# EAGLE design Traid (EAGLE 5.11)
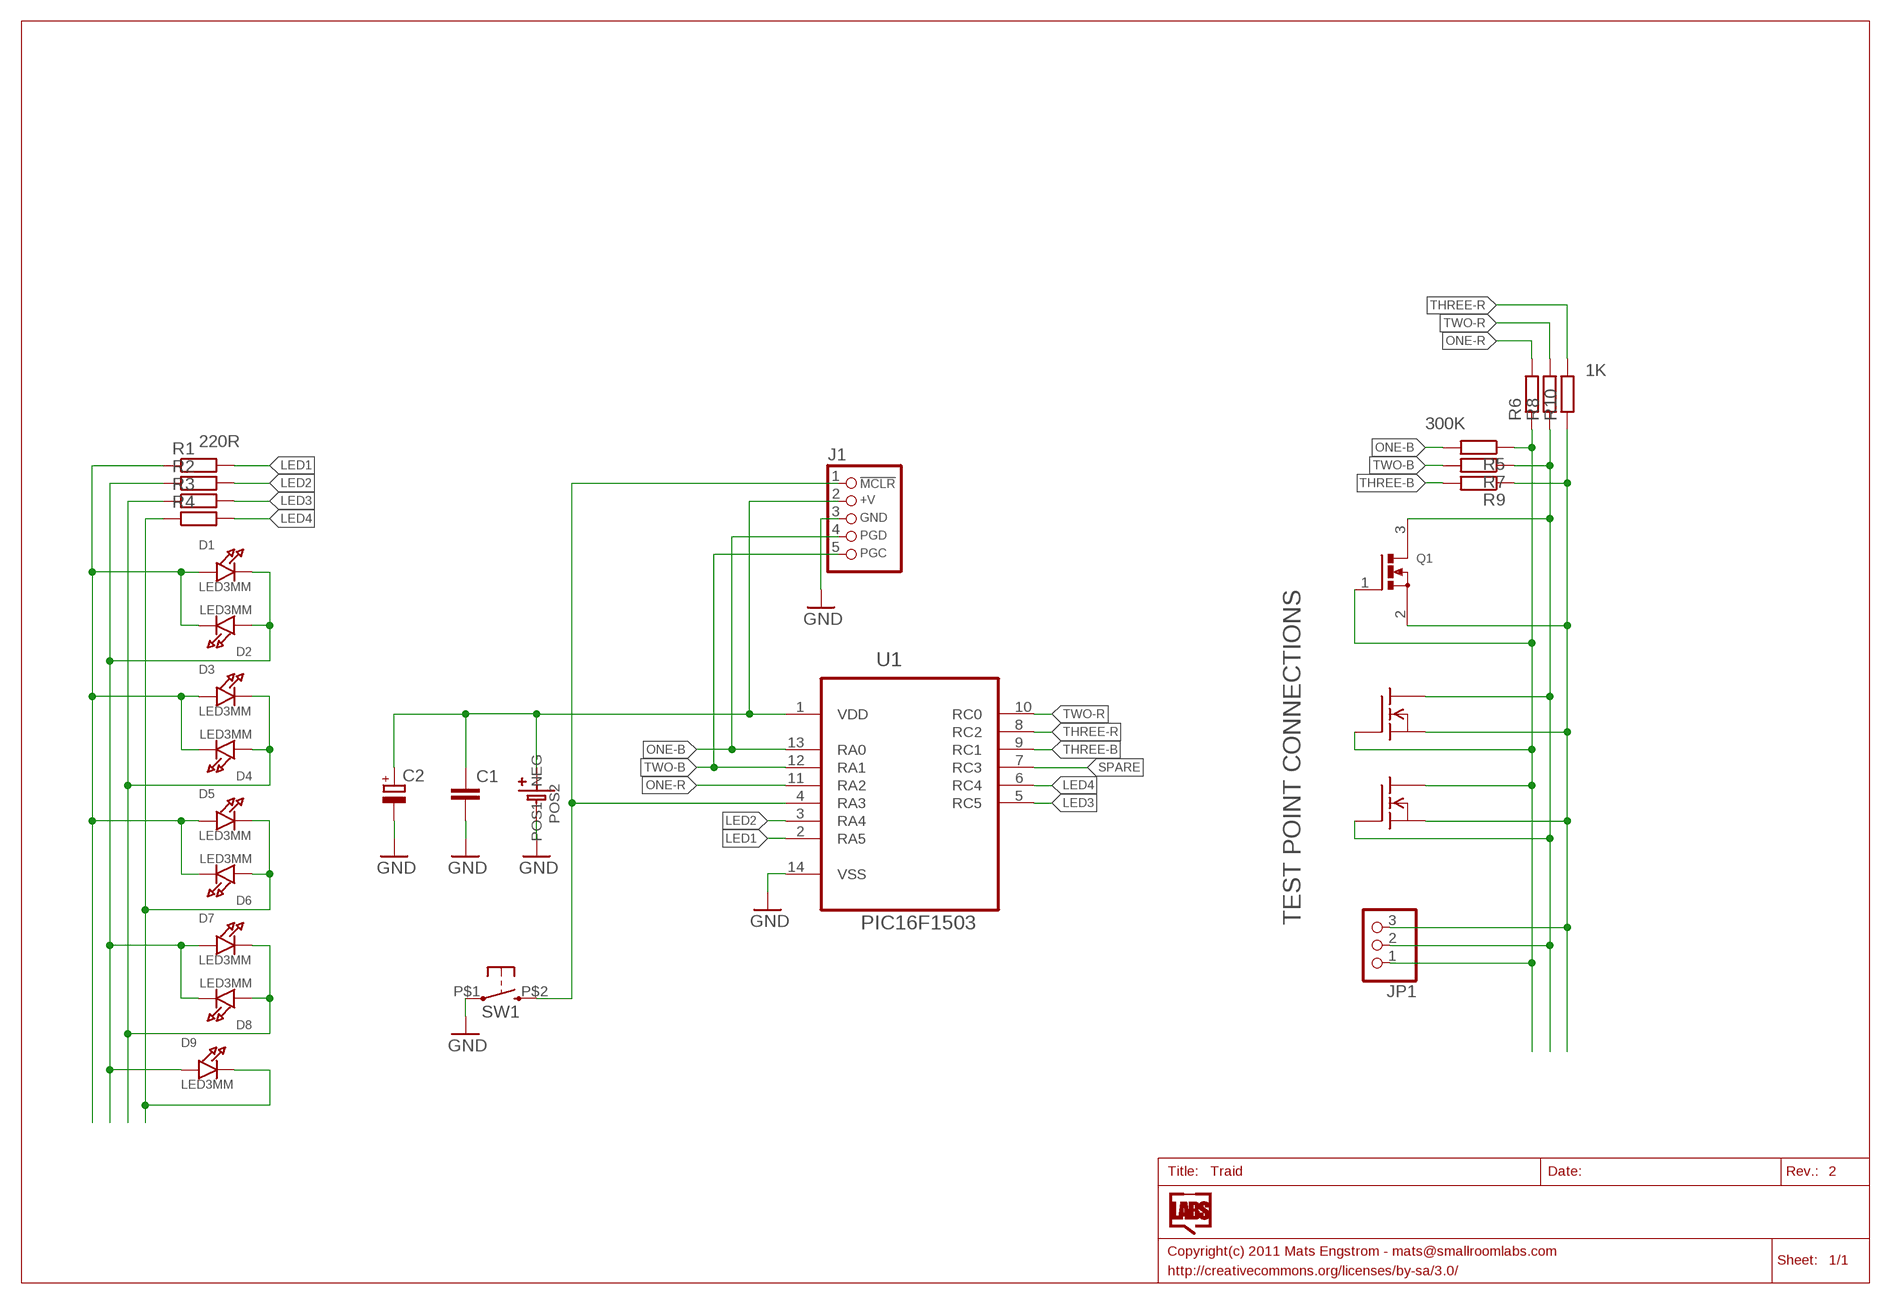
[diagram p0: schematic, sheet 1]

## Parts
C1  C-EU025-025X050  [C025-025X050]
C2  CPOL-EUE2.5-5  [E2,5-5]
D1  LED3MM  [LED3MM]
D2  LED3MM  [LED3MM]
D3  LED3MM  [LED3MM]
D4  LED3MM  [LED3MM]
D5  LED3MM  [LED3MM]
D6  LED3MM  [LED3MM]
D7  LED3MM  [LED3MM]
D8  LED3MM  [LED3MM]
D9  LED3MM  [LED3MM]
J1  CON_HEADER_PRG_PIC_ICSPB  [HEADER_PRG_1X05_ICSP_B]
JP1  HEADER-1X3ROUND  [1X03_ROUND]
Q1  MOSFET-NWAVE  [SOT23-W]
Q2  FQN1N50C  [TO92]
Q3  FQN1N50CI  [TO92-INLINE]
R1  R-EU_0204/5  [0204/5]
R2  R-EU_0204/5  [0204/5]
R3  R-EU_0204/5  [0204/5]
R4  R-EU_0204/5  [0204/5]
R5  R-EU_0204/5  [0204/5]
R6  R-EU_0204/5  [0204/5]
R7  R-EU_0204/5  [0204/5]
R8  R-EU_0204/5  [0204/5]
R9  R-EU_0204/5  [0204/5]
R10  R-EU_0204/5  [0204/5]
SW1  TACTILE1PTH  [TACT3X6PTH]
U1  PIC16F1503  [DIL14-A]
U$3  BATTERY-NOBOTSTOP  [CR2032-PTH-CHEAP]

## Nets
GND [pwr]: C1.2 C2.- J1.3(GND) SW1.P$1(1A) U1.14(VSS) U$3.NEG
LED1: R1.2 U1.2(RA5)
LED1A: D1.A D2.C D3.A D4.C D5.A D6.C R1.1
LED2: R2.2 U1.3(RA4)
LED2A: D1.C D2.A D7.A D8.C D9.A R2.1
LED3: R3.2 U1.5(RC5)
LED3A: D3.C D4.A D7.C D8.A R3.1
LED4: R4.2 U1.6(RC4)
LED4A: D5.C D6.A D9.C R4.1
N$1 [pwr]: C1.1 C2.+ J1.2(+V) U1.1(VDD) U$3.POS@1(POS1)
ONE: JP1.1 Q1.1(G) Q2.1(G) Q3.1(D) R5.1 R6.1
ONE-B: J1.4(PGD) R5.2 U1.13(RA0)
ONE-R: R6.2 U1.11(RA2)
RESET: J1.1(/MCLR) SW1.P$2(2A) U1.4(RA3)
SPARE: U1.7(RC3)
THREE: JP1.3 Q1.2(S) Q2.3(S) Q3.3(S) R9.1 R10.1
THREE-B: R9.2 U1.9(RC1)
THREE-R: R10.2 U1.8(RC2)
TWO: JP1.2 Q1.3(D) Q2.2(D) Q3.2(G) R7.1 R8.1
TWO-B: J1.5(PGC) R7.2 U1.12(RA1)
TWO-R: R8.2 U1.10(RC0)

## Notes on the sheet
- 1K
- 300K
- 220R
- TEST POINT CONNECTIONS

## Power pins joined to a net without a drawn wire
POS2: U$3.POS@3(POS2)

## Library data of the parts
C1 = rcl:C-EU: CAPACITOR, European symbol
C2 = rcl:CPOL-EU: POLARIZED CAPACITOR, European symbol
D1-D9 = SmallRoomLabs:LED
J1 = dp_devices:CON_HEADER_PRG_PIC_ICSP: 5-pin PIC In Circuit Serial Programming header
JP1 = microbuilder:HEADER-1X3: PIN HEADER
Q1 = microbuilder:MOSFET-N: N-Channel Mosfet Digikey: 2N7002ET1GOSTR-ND
Q2 Q3 = adafruit:FQN1N50C: N-Channel Enhancement MOSFET 500V, 0.4A, 6.0 Ohm
R1-R10 = resistor:R-EU_: RESISTOR, European symbol
SW1 = SmallRoomLabs:TACTILE1
U1 = SmallRoomLabs:PIC16F1503: MCU 8BIT 3.5KB FLASH ,DIP-14; MPN: PIC16F1503-I/P; OC_FARNELL: 2068608; OC_NEWARK: 55T3633; PACKAGE: DIP-14; SUPPLIER: Microchip
U$3 = SmallRoomLabs:BATTERY: A23 Farnell/E14 908721

## Net classes
0 default: width 0.203 mm, drill 0.305 mm, clearance 0.203 mm
1 pwr: width 0.356 mm, drill 0.305 mm, clearance 0.356 mm

## Board
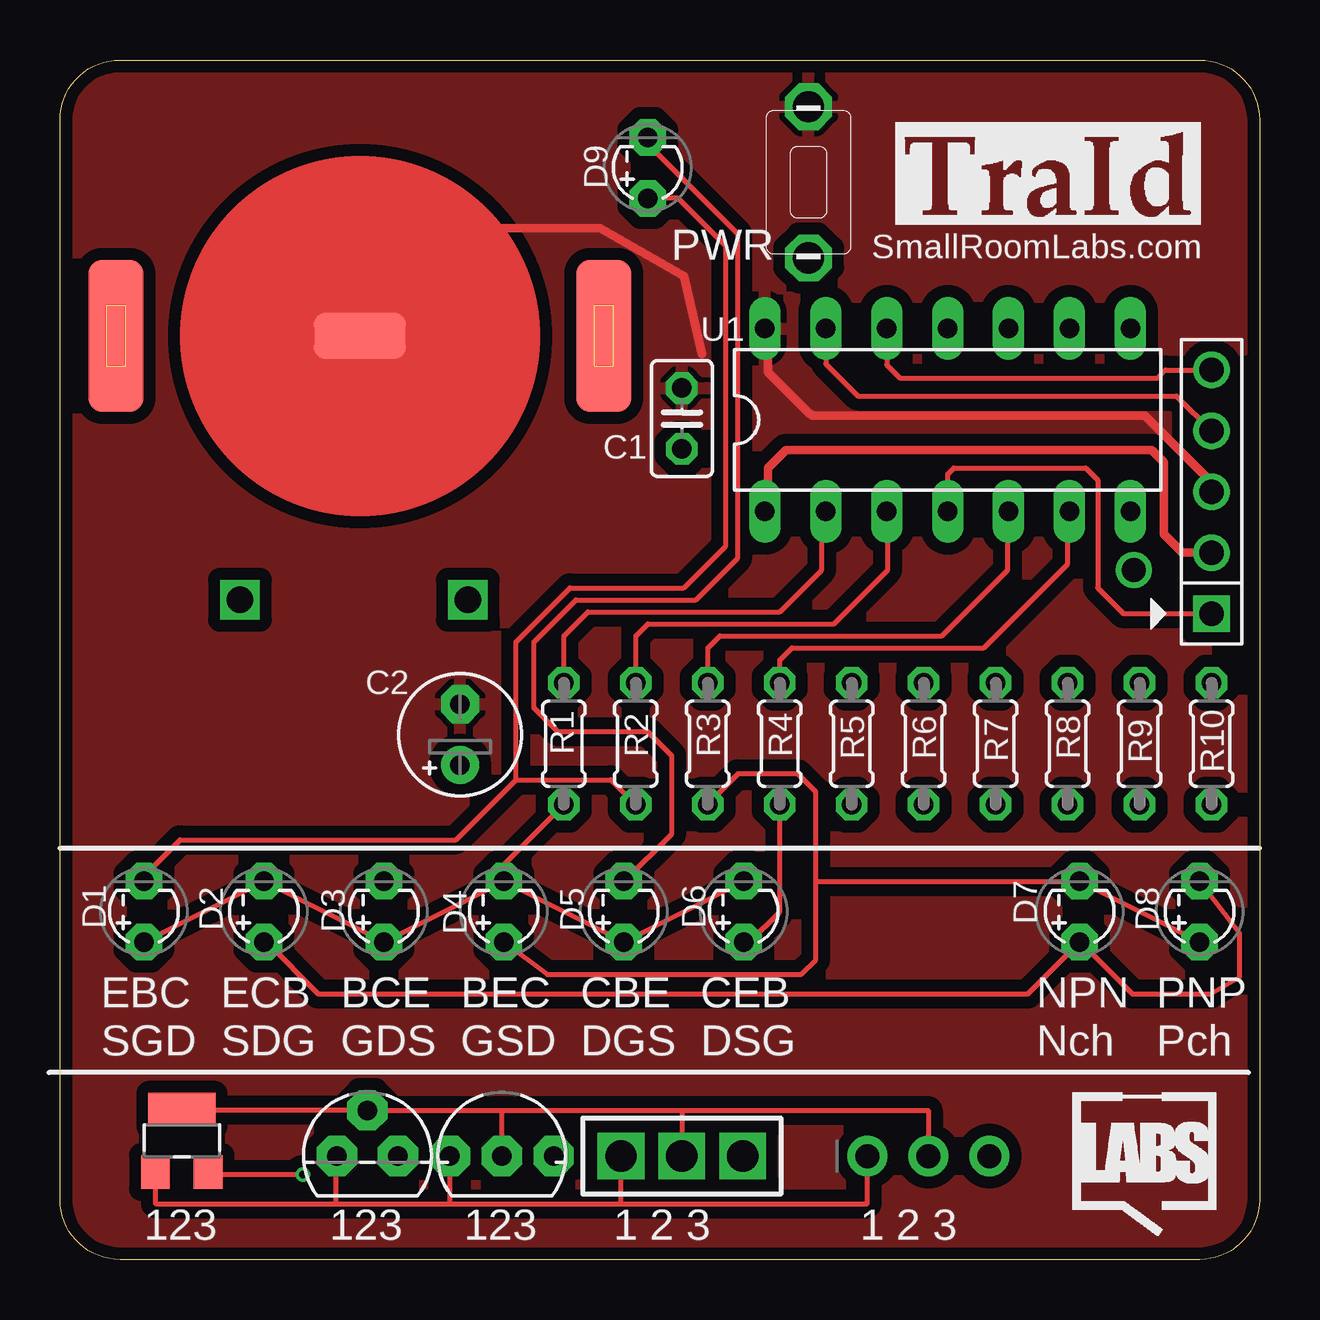
[diagram p1: board, top side]
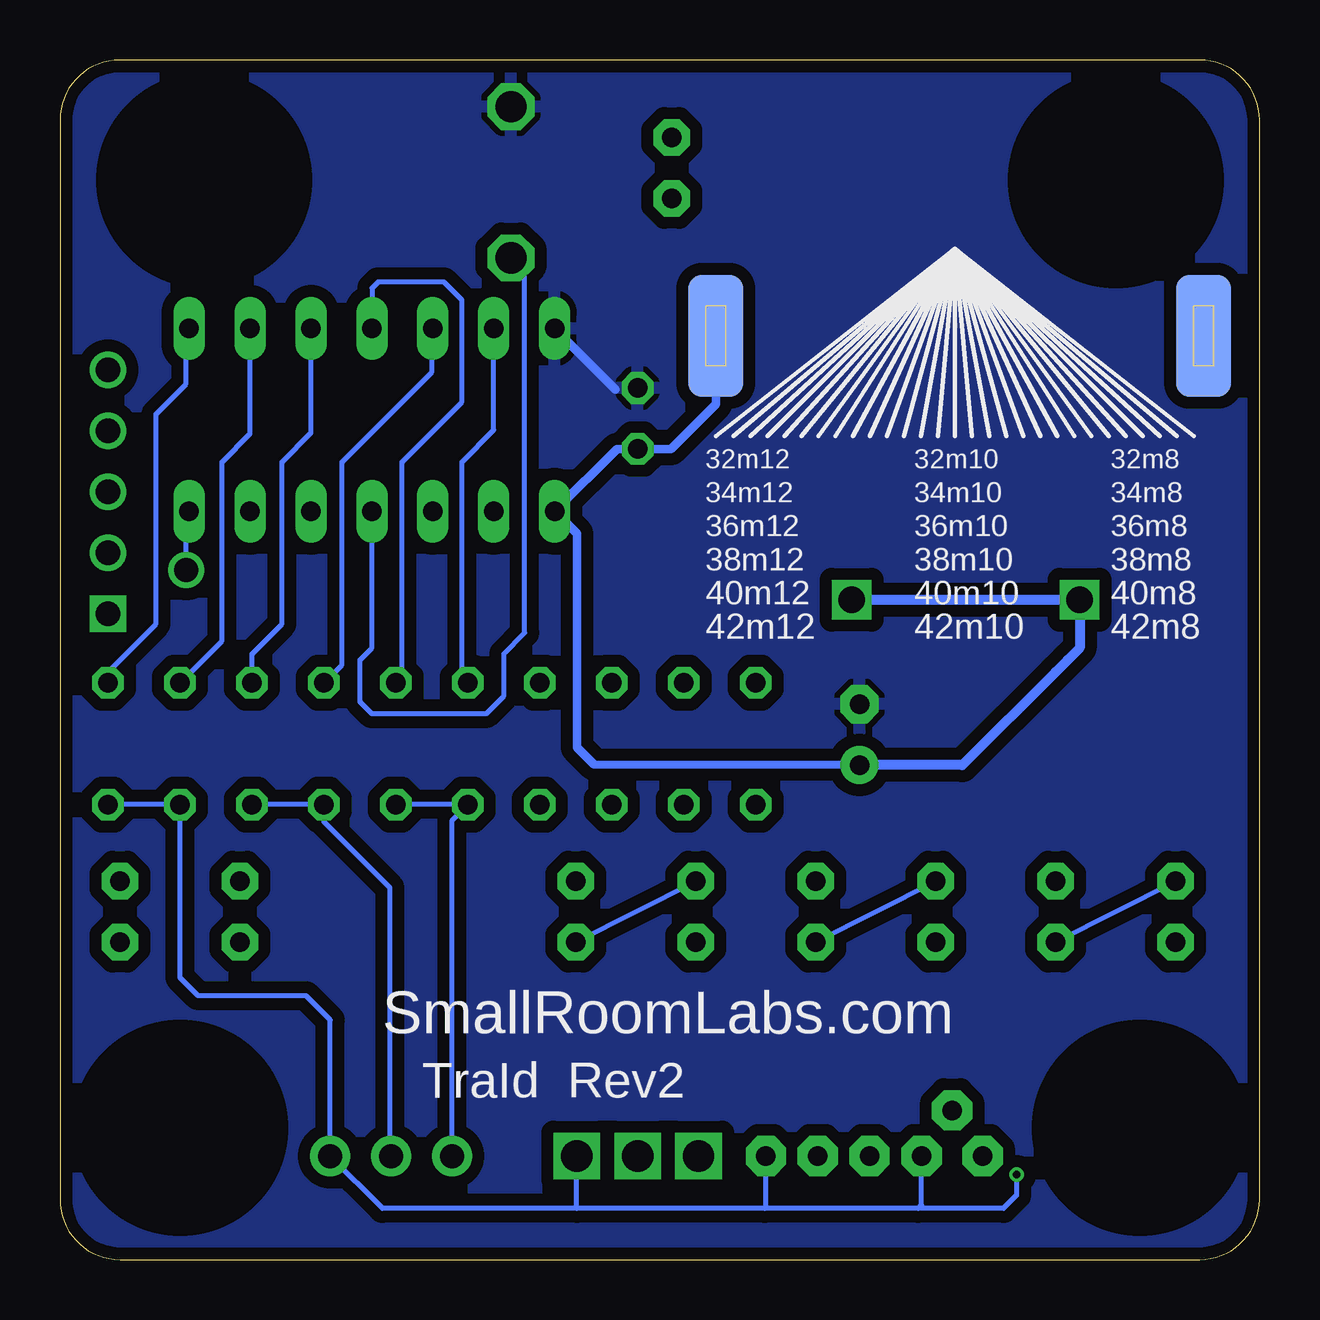
[diagram p2: board, bottom side, seen from below]

Size 50 x 50 mm. Coordinates in mm from the lower left corner, seen from the top.
Outline: 0,47.5 arc-90 2.5,50 47.5,50 arc-90 50,47.5 50,2.5 arc-90 47.5,0 2.5,0 arc-90 0,2.5 0,47.5
Copper layers (1*16): Top 0.035mm / dielectric 1.5mm / Bottom 0.035mm
Design rules "SmartPrototyping": minimum track width 7mil, minimum drill 12mil, track to track 7mil, track to pad 7mil, pad to pad 7mil, via to via 7mil, smd to smd 0mil, copper to edge 20mil, drill to drill 10mil, minimum pad ring 10mil, minimum via ring 6mil, stop-mask expansion 2mil, vias tented up to drill 25mil, thermal gap 10mil
tRestrict: area 30.1,32.2 to 36.3,33; area 46.8,29.8 to 49.7,35.9; area 45.5,27 to 49.5,29; area 48.5,24.5 to 49.5,26; area 12,3 to 13.5,3.5; area 34.5,4.5 to 35.5,6; area 33,36.5 to 34.5,38
bRestrict: area 2,41 to 10,49; area 40,41 to 48,49; area 41,1.5 to 49,9.5; area 1,1.5 to 9,9.5; area 46.4,27.9 to 47.5,29; area 48.7,27.9 to 49.7,28.9; area 48.3,24.5 to 49.7,25.9; area 48.7,35.1 to 49.7,36.1; area 42.8,39.8 to 43.8,40.8; area 12.3,2.7 to 13.3,3.7; area 21.3,2.7 to 22.1,3.5; area 14.7,2.6 to 15.7,3.6; 5 more areas

### Footprints (pad centres in the part's own frame; a part is rotated, then mirrored left to right if it is on the bottom)
C025-025X050 = drill 0.813 octagon: 1 -1.27,0; 2 1.27,0
E2,5-5 = drill 0.813 pad 1.6 round: + -1.27,0 | drill 0.813 pad 1.6 octagon: - 1.27,0
LED3MM = drill 0.8 pad 1.524 octagon: A -1.27,0; C 1.27,0
HEADER_PRG_1X05_ICSP_B = drill 1.016 square: 1 -5.08,0 | drill 1.016 round: 2 -2.54,0; 3 0,0; 4 2.54,0; 5 5.08,0
1X03_ROUND = drill 1 pad 1.676 round: 1 -2.54,0; 2 0,0; 3 2.54,0
SOT23-W = smd 1.2 x 1.4: 1 -1.1,-1.3; 2 1.1,-1.3 | smd 2.8 x 1.4: 3 0,1.3
TO92 = drill 0.813 pad 1.676 octagon: 1 -1.27,0; 2 0,1.905; 3 1.27,0
TO92-INLINE = drill 0.813 pad 1.676 octagon: 1 -2.159,0; 2 0,0; 3 2.159,0
0204/5 = drill 0.813 octagon: 1 -2.54,0; 2 2.54,0
TACT3X6PTH = drill 1.3 octagon: P$1 -3.15,0; P$2 3.15,0
DIL14-A = drill 0.813 long: 1 -7.62,-3.81; 2 -5.08,-3.81; 3 -2.54,-3.81; 4 0,-3.81; 5 2.54,-3.81; 6 5.08,-3.81; 7 7.62,-3.81; 8 7.62,3.81; 9 5.08,3.81; 10 2.54,3.81; 11 0,3.81; 12 -2.54,3.81; 13 -5.08,3.81; 14 -7.62,3.81
CR2032-PTH-CHEAP = smd 3.81 x 1.905: NEG 0,0 | smd 2.3 x 5.08 bottom: POS@1 -10.16,0; POS@4 10.16,0 | smd 2.3 x 6.35: POS@2 -10.16,0; POS@3 10.16,0

### Placement (x,y rotation side)
C1  25.92,35.06 90 top
C2  16.68,21.88 90 top
D1  3.5,14.5 90 top
D2  8.5,14.5 90 top
D3  13.5,14.5 90 top
D4  18.5,14.5 90 top
D5  23.5,14.5 90 top
D6  28.5,14.5 90 top
D7  42.5,14.5 90 top
D8  47.5,14.5 90 top
D9  24.5,45.5 90 top
J1  48,32 90 top
JP1  36.2,4.31 0 top
Q1  5.08,4.95 0 top
Q2  12.81,4.31 0 top
Q3  18.41,4.31 0 top
R1  21,21.5 90 top
R2  24,21.5 90 top
R3  27,21.5 90 top
R4  30,21.5 90 top
R5  33,21.5 90 top
R6  36,21.5 90 top
R7  39,21.5 90 top
R8  42,21.5 90 top
R9  45,21.5 90 top
R10  48,21.5 90 top
SW1  31.2,44.9 270 top
U1  37,35 0 top
U$2  [SRL-LOGO-SILK-5MM]  42.16,2.03 0 top
U$3  12.5,38.5 180 top

### Tracks (layer width: path | path; a pad name or v marks a point on that pad's centre or on a via)
GND
  Top 0.356: U$3.NEG 17,43 22.5,43 26,41 26.75,37.75 | U1.14 29.5,38.69 29.5,37 31.25,35.25 31.3,35.25 31.37,35.18 45.21,35.18 48,32.39 J1.3
  Bottom 0.356: 26.84,36.27 U1.14
  pour Bottom (isolate 0.5): 0,25 0,47.5 arc-90 2.5,50 25,50 47.5,50 arc-90 50,47.5 50,25 50,2.5 arc-90 47.5,0 25,0 2.5,0 arc-90 0,2.5
  pour Top (isolate 0.5): 25,0 2.5,0 arc-90 0,2.5 0,25 0,47.5 arc-90 2.5,50 25,50 47.5,50 arc-90 50,47.5 50,25 50,2.5 arc-90 47.5,0
LED1
  Top 0.203: R1.2 21,26 22,27 30,27 31.75,28.75 31.75,31.02 U1.2
LED1A
  Top 0.203: D1.A D2.C D3.A D4.C | D4.C D5.A D6.C | R1.1 18.5,16.46 D4.C
LED2
  Top 0.203: R2.2 24,26 24.5,26.5 32.25,26.5 34.5,28.75 34.5,31.15 U1.3
LED2A
  Top 0.203: D2.A 8.61,13.23 10.77,11.07 40.34,11.07 D7.A 42.54,13.23 44.7,11.07 47.95,11.07 49.17,11.79 49.17,13.6 D8.C | D1.C 3.5,16 5,17.5 16.5,17.5 19,20 | 19,20 19,25.75 21.25,28 26,28 27.75,29.75 27.75,42.25 25.77,44.23 D9.A | R2.1 22.96,20 19,20
  Bottom 0.203: D1.C D2.A
LED3
  Top 0.203: R3.2 27,25.5 27.5,26 36.75,26 39.5,28.75 39.5,31.15 U1.5
LED3A
  Top 0.203: D8.A D7.C 31.5,15.77 | D4.A 20.32,11.88 30.88,11.88 31.5,12.5 31.5,15.5 31.5,15.77 | R3.1 27,19 28.25,20.25 30.75,20.25 31.5,19.5 31.5,15.77
  Bottom 0.203: D3.C D4.A
LED4
  Top 0.203: R4.2 30,25 30.5,25.5 38.5,25.5 42,29 42,31.11 U1.6
LED4A
  Top 0.203: D6.A 28.73,13.23 30,14.5 R4.1 | D5.C 23.52,15.77 25.5,17.75 25.5,21 24.5,22 20.75,22 19.75,23 19.75,25.75 21.5,27.5 26.5,27.5 28.25,29.25 28.25,42.75 24.5,46.5 D9.C
  Bottom 0.203: D5.C D6.A
N$1  (via drill 1.1)
  Top 0.356: J1.2 46.79,29.46 46,30.25 46,33.25 45.5,33.75 30.25,33.75 29.5,33 29.5,31.31 U1.1
  Bottom 0.356: U$3.POS@1 22.66,35.66 24.53,33.79 C1.1 26.78,33.79 U1.1 28.45,30.26 28.45,21.34 27.75,20.64 C2.+
  Bottom 0.406: C2.+ 12.39,20.61 8.5,24.5 8,25 7.5,25.5 v7.5,27.5 v17,27.5
ONE  (via drill 1.3)
  Top 0.203: Q1.1 3.98,2.33 11.52,2.33 | 11.52,2.33 11.52,4.31 Q2.1 | 16.26,2.33 Q3.1 | 11.52,2.33 16.26,2.33 | 23.38,2.33 v23.38,4.31 | 16.26,2.33 23.38,2.33 | JP1.1 33.66,2.33 23.38,2.33
  Bottom 0.203: R6.1 R5.1 33.66,18.3 JP1.1
ONE-B
  Top 0.203: J1.4 46.54,36 33.25,36 31.92,37.33 U1.13
  Bottom 0.203: R5.2 33.25,24.29 33.25,33.25 31.92,34.58 U1.13
ONE-R
  Bottom 0.203: U1.11 37,40.5 36.75,40.75 34,40.75 33.25,40 33.25,35.75 35.75,33.25 35.75,24.29 R6.2
RESET
  Top 0.203: J1.1 44.33,26.92 43.25,28 43.25,32.5 42.75,33 37.25,33 37,32.75 U1.4
  Bottom 0.203: U1.4 37,25.5 37.5,25 37.5,23.25 37,22.75 32.25,22.75 31.5,23.5 31.5,25.25 30.63,26.12 30.63,41.18 SW1.P$2
SPARE  (via drill 1)
  Bottom 0.203: v44.75,28.75 44.75,31.06 U1.7
THREE  (via drill 0.3, 1.3)
  Top 0.203: Q1.2 6.18,3.55 v10.13,3.55
  Bottom 0.203: R10.1 R9.1 45,11.75 44.25,11 39.75,11 38.73,9.98 JP1.3 36.56,2.13 28.45,2.13 | v10.13,3.55 10.13,2.67 10.67,2.13 14.22,2.13 | 14.22,2.13 20.62,2.13 | 20.62,2.13 28.45,2.13 | v28.46,4.31 28.46,2.15 28.45,2.13 | Q3.3 20.57,2.18 20.62,2.13 | Q2.3 14.09,2.27 14.22,2.13
THREE-B
  Bottom 0.203: R9.2 43.25,25.79 43.25,33.25 42.08,34.42 U1.9
THREE-R
  Bottom 0.203: R10.2 48,24.5 46,26.5 46,35.25 44.75,36.5 44.75,38.68 U1.8
TWO  (via drill 1.3)
  Top 0.203: Q1.3 12.81,6.25 Q2.2 18.41,6.21 | 18.41,6.21 Q3.2 | 25.92,6.21 v25.92,4.31 | 18.41,6.21 25.92,6.21 | JP1.2 36.2,6.21 25.92,6.21
  Bottom 0.203: JP1.2 36.25,4.37 36.25,15.5 39,18.25 R7.1 R8.1
TWO-B
  Top 0.203: J1.5 46.08,37.08 45.75,36.75 35,36.75 34.46,37.29 U1.12
  Bottom 0.203: R7.2 38.25,24.79 38.25,33.25 34.5,37 34.5,38.25 34.46,38.29 U1.12
TWO-R
  Bottom 0.203: U1.10 39.54,34.46 40.75,33.25 40.75,26.5 42,25.25 R8.2

### Text on the board
tPlace: PWR | SmallRoomLabs.com | EBC | ECB | BCE | BEC | CBE | CEB | NPN | PNP | SGD | SDG | GDS | GSD | DGS | DSG | Nch | Pch | 123 | 123 | 123 | 1 2 3 | 1 2 3
bPlace: 32m8 | 32m10 | 32m12 | 34m8 | 34m10 | 34m12 | 36m8 | 36m10 | 36m12 | 38m8 | 38m10 | 38m12 | 40m8 | 40m10 | 40m12 | 42m8 | 42m10 | 42m12 | SmallRoomLabs.com | TraId Rev2